# Altium schematic sheet cpu.SchDoc: Control
size A4; Address4: Niklas Fauth; Revision: V1.0; SheetNumber: 5; SheetTotal: 5
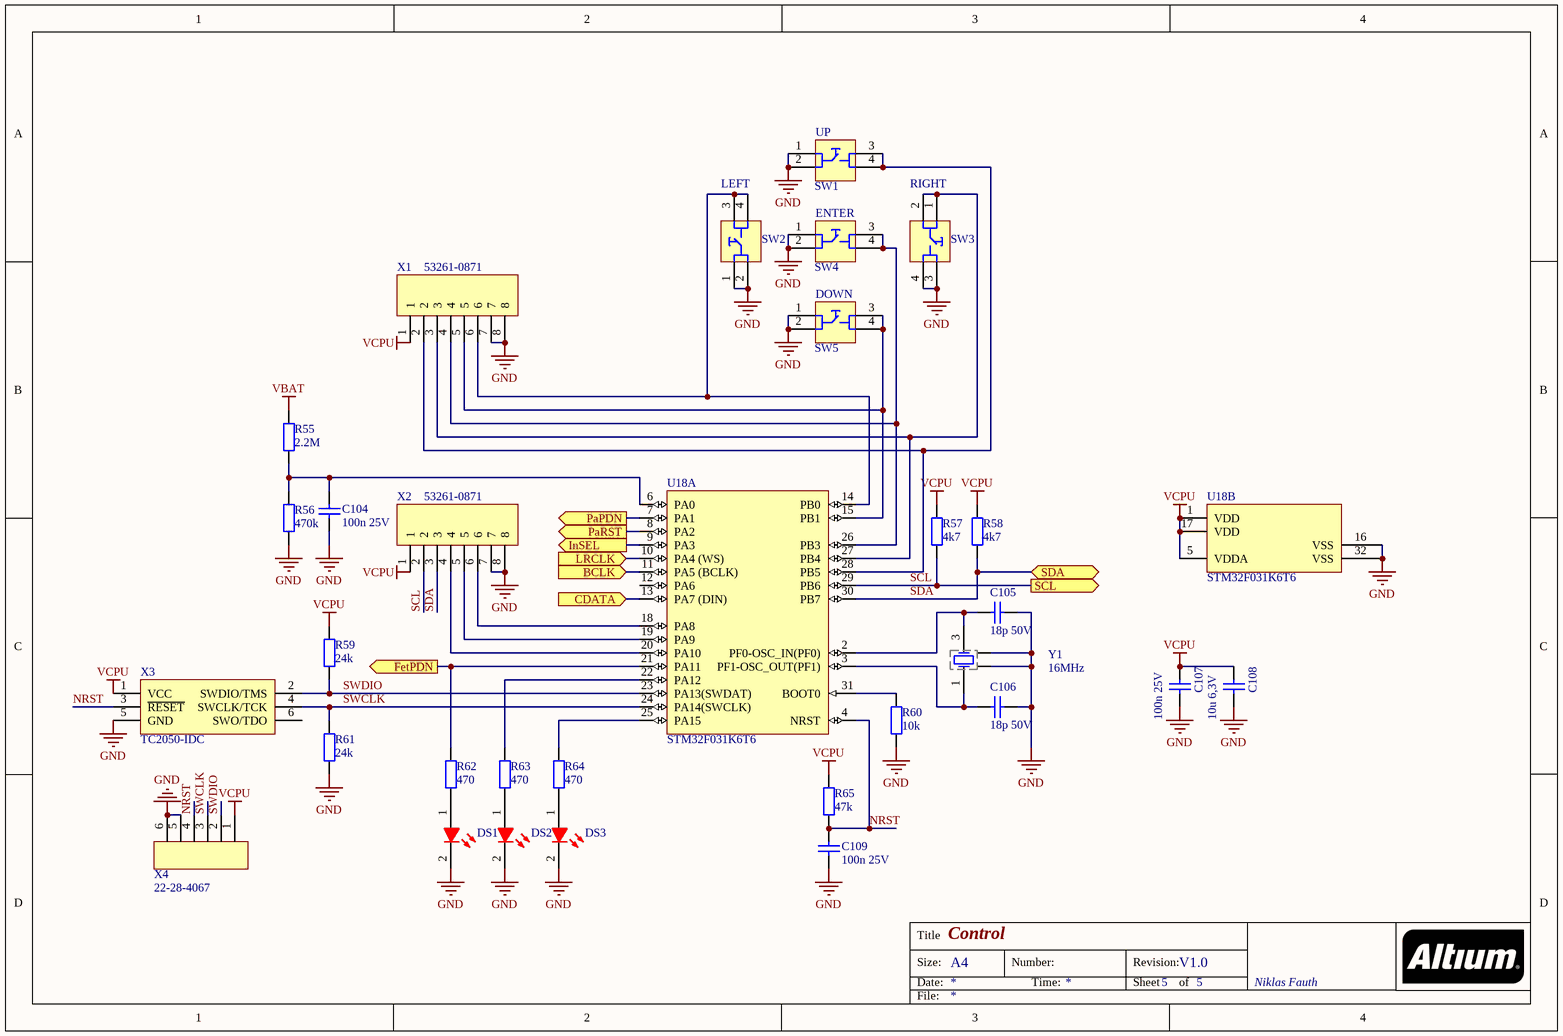
[diagram p0: cpu.SchDoc]

## Parts
C104  100n 25V  [C-0603-H]
C105  18p 50V  [C-0402-M]
C106  18p 50V  [C-0402-M]
C107  100n 25V  [C-0603-H]
C108  10u 6,3V  [C-0603-H]
C109  100n 25V  [C-0603-H]
DS1  LED-0603-RED  [LED-0603-RED]  (value not drawn)
DS2  LED-0603-RED  [LED-0603-RED]  (value not drawn)
DS3  LED-0603-RED  [LED-0603-RED]  (value not drawn)
R55  2.2M  [R-0603-H]
R56  470k  [R-0603-H]
R57  4k7  [R-0603-H]
R58  4k7  [R-0603-H]
R59  24k  [R-0402-M]
R60  10k  [R-0603-H]
R61  24k  [R-0402-M]
R62  470  [R-0603-H]
R63  470  [R-0603-H]
R64  470  [R-0603-H]
R65  47k  [R-0603-H]
SW1  UP  [BUTTON_TACT]
SW2  LEFT  [BUTTON_TACT]
SW3  RIGHT  [BUTTON_TACT]
SW4  ENTER  [BUTTON_TACT]
SW5  DOWN  [BUTTON_TACT]
U18  STM32F031K6T6  [LQFP32]  (parts A,B of 2)
X1  53261-0871  [mlx-picoBlade-8p-right-SMD]
X2  53261-0871  [mlx-picoBlade-8p-right-SMD]
X3  TC2050-IDC  [TC2030-IDC]
X4  22-28-4067  [PINHEAD-MALE-6]
Y1  16MHz  [ABM10]

## Ports
BCLK (in), CDATA (in), FetPDN (out), InSEL (out), LRCLK (in), PaPDN (out), PaRST (out), SCL (out), SDA (bidir)

## Nets
GND: C104.1 C105.2 C106.2 C107.1 C108.1 C109.1 DS1.2(K) DS2.2(K) DS3.2(K) R56.1 R60.1 R61.1 SW1.1 SW1.2 SW2.1 SW2.2 SW3.3 SW3.4 SW4.1 SW4.2 SW5.1 SW5.2 U18.16(VSS) U18.32(VSS) X1.7 X1.8 X2.7 X2.8 X3.5(GND) X4.5 X4.6 Y1.2 Y1.4
VBAT: R55.2
VCPU: C107.2 C108.2 R57.2 R58.2 R59.2 R65.2 U18.1(VDD) U18.5(VDDA) U18.17(VDD) X1.1 X2.1 X3.1(VCC) X4.1
BCLK: U18.11(PA5_(BCLK)) ; port BCLK
CDATA: U18.13(PA7_(DIN)) ; port CDATA
FetPDN: R62.2 U18.21(PA11) ; port FetPDN
InSEL: U18.9(PA3) ; port InSEL
LRCLK: U18.10(PA4_(WS)) ; port LRCLK
NRST: C109.2 R65.1 U18.4(NRST) X3.3(~{RESET}) X4.4
PaPDN: U18.7(PA1) ; port PaPDN
PaRST: U18.8(PA2) ; port PaRST
SCL: R57.1 U18.29(PB6) X2.2 ; port SCL
SDA: R58.1 U18.30(PB7) X2.3 ; port SDA
SWCLK: R61.2 U18.24(PA14(SWCLK)) X3.4(SWCLK/TCK) X4.3
SWDIO: R59.1 U18.23(PA13(SWDAT)) X3.2(SWDIO/TMS) X4.2
NetC104_2: C104.2 R55.1 R56.2 U18.6(PA0)
NetC105_1: C105.1 U18.2(PF0-OSC_IN(PF0)) Y1.3
NetC106_1: C106.1 U18.3(PF1-OSC_OUT(PF1)) Y1.1
NetDS1_1: DS1.1(A) R62.1
NetDS2_1: DS2.1(A) R63.1
NetDS3_1: DS3.1(A) R64.1
NetR60_2: R60.2 U18.31(BOOT0)
NetR63_2: R63.2 U18.22(PA12)
NetR64_2: R64.2 U18.25(PA15)
NetSW1_3: SW1.3 SW1.4 U18.28(PB5) X1.2
NetSW2_3: SW2.3 SW2.4 U18.14(PB0) X1.6
NetSW3_1: SW3.1 SW3.2 U18.27(PB4) X1.3
NetSW4_3: SW4.3 SW4.4 U18.26(PB3) X1.4
NetSW5_3: SW5.3 SW5.4 U18.15(PB1) X1.5
NetU18_18: U18.18(PA8) X2.6
NetU18_19: U18.19(PA9) X2.5
NetU18_20: U18.20(PA10) X2.4

Not connected (* = marked no-connect by the designer): U18 12(PA6); X3 6(SWO/TDO)

## Notes on the sheet
- Title
- Size:
- Date:
- A4
- Number:
- Time:
- Revision:
- Sheet
- of
- File:

## Library data of the parts
C104 C107 C109 = C-0603-100n-25V: Capacitor 100n 25V; Supplier 1: Mouser; Supplier Part Number 1: 80-C0603C104K3R
C105 C106 = C-0402-18p-50V: Capacitor 18p 50V; Supplier 1: Mouser; Supplier Part Number 1: 80-C0402C180J5G
C108 = C-0603-10u-6,3V: Capacitor 10uF 6,3V; Supplier 1: Mouser; Supplier Part Number 1: 80-C0603C106M9P
R55 = R-0603-2M2: Resistor 2.2M; Supplier 1: Mouser; Supplier Part Number 1: 71-CRCW06032M20FKEA
R56 = R-0603-470k: Resistor 470k; Supplier 1: Mouser; Supplier Part Number 1: 71-CRCW0603-470K-E3
R57 R58 = R-0603-4k7: Resistor 4k7; Supplier 1: Mouser; Supplier Part Number 1: 71-CRCW0603-4.7K-E3
R59 R61 = R-0402-24k: Resistor 24k; Supplier 1: Mouser; Supplier Part Number 1: 71-CRCW0402-24K-E3
R60 = R-0603-10k: Resistor 10k; Supplier 1: Mouser; Supplier Part Number 1: 71-CRCW0603-10K-E3
R62-R64 = R-0603-470: Resistor 470; Supplier 1: Mouser; Supplier Part Number 1: 71-CRCW0603-470K-E3
R65 = R-0603-47k: Resistor 4k7; Supplier 1: Mouser; Supplier Part Number 1: 71-CRCW060347K0FKEB
SW1-SW5 = SWITCH-TACTILE: Supplier 1: Mouser; Supplier Part Number 1: 611-PTS645SL43SMTR92
X1 X2 = MLX-picoBlade-8P-right-SMD: Supplier 1: Mouser; Supplier Part Number 1: 538-53261-0871
X3 = TAG-Connect-SWD: TC2050-IDC SWD
X4 = PINHEAD-MALE-6: Supplier 1: Mouser; Supplier Part Number 1: 538-22-28-4067
Y1 = ABM10-16MHz: Supplier 1: Mouser; Supplier Part Number 1: 815-ABM10-16-D30T3
DS1-DS3 = LED-0603-RED: Supplier 1: Mouser; Supplier Part Number 1: 859-LTST-C190EKT
U18 = STM32F031K6T6: Supplier 1: Mouser; Supplier Part Number 1: 511-STM32F031K6T6